# Altium project Blackbox_v3.PrjPcb
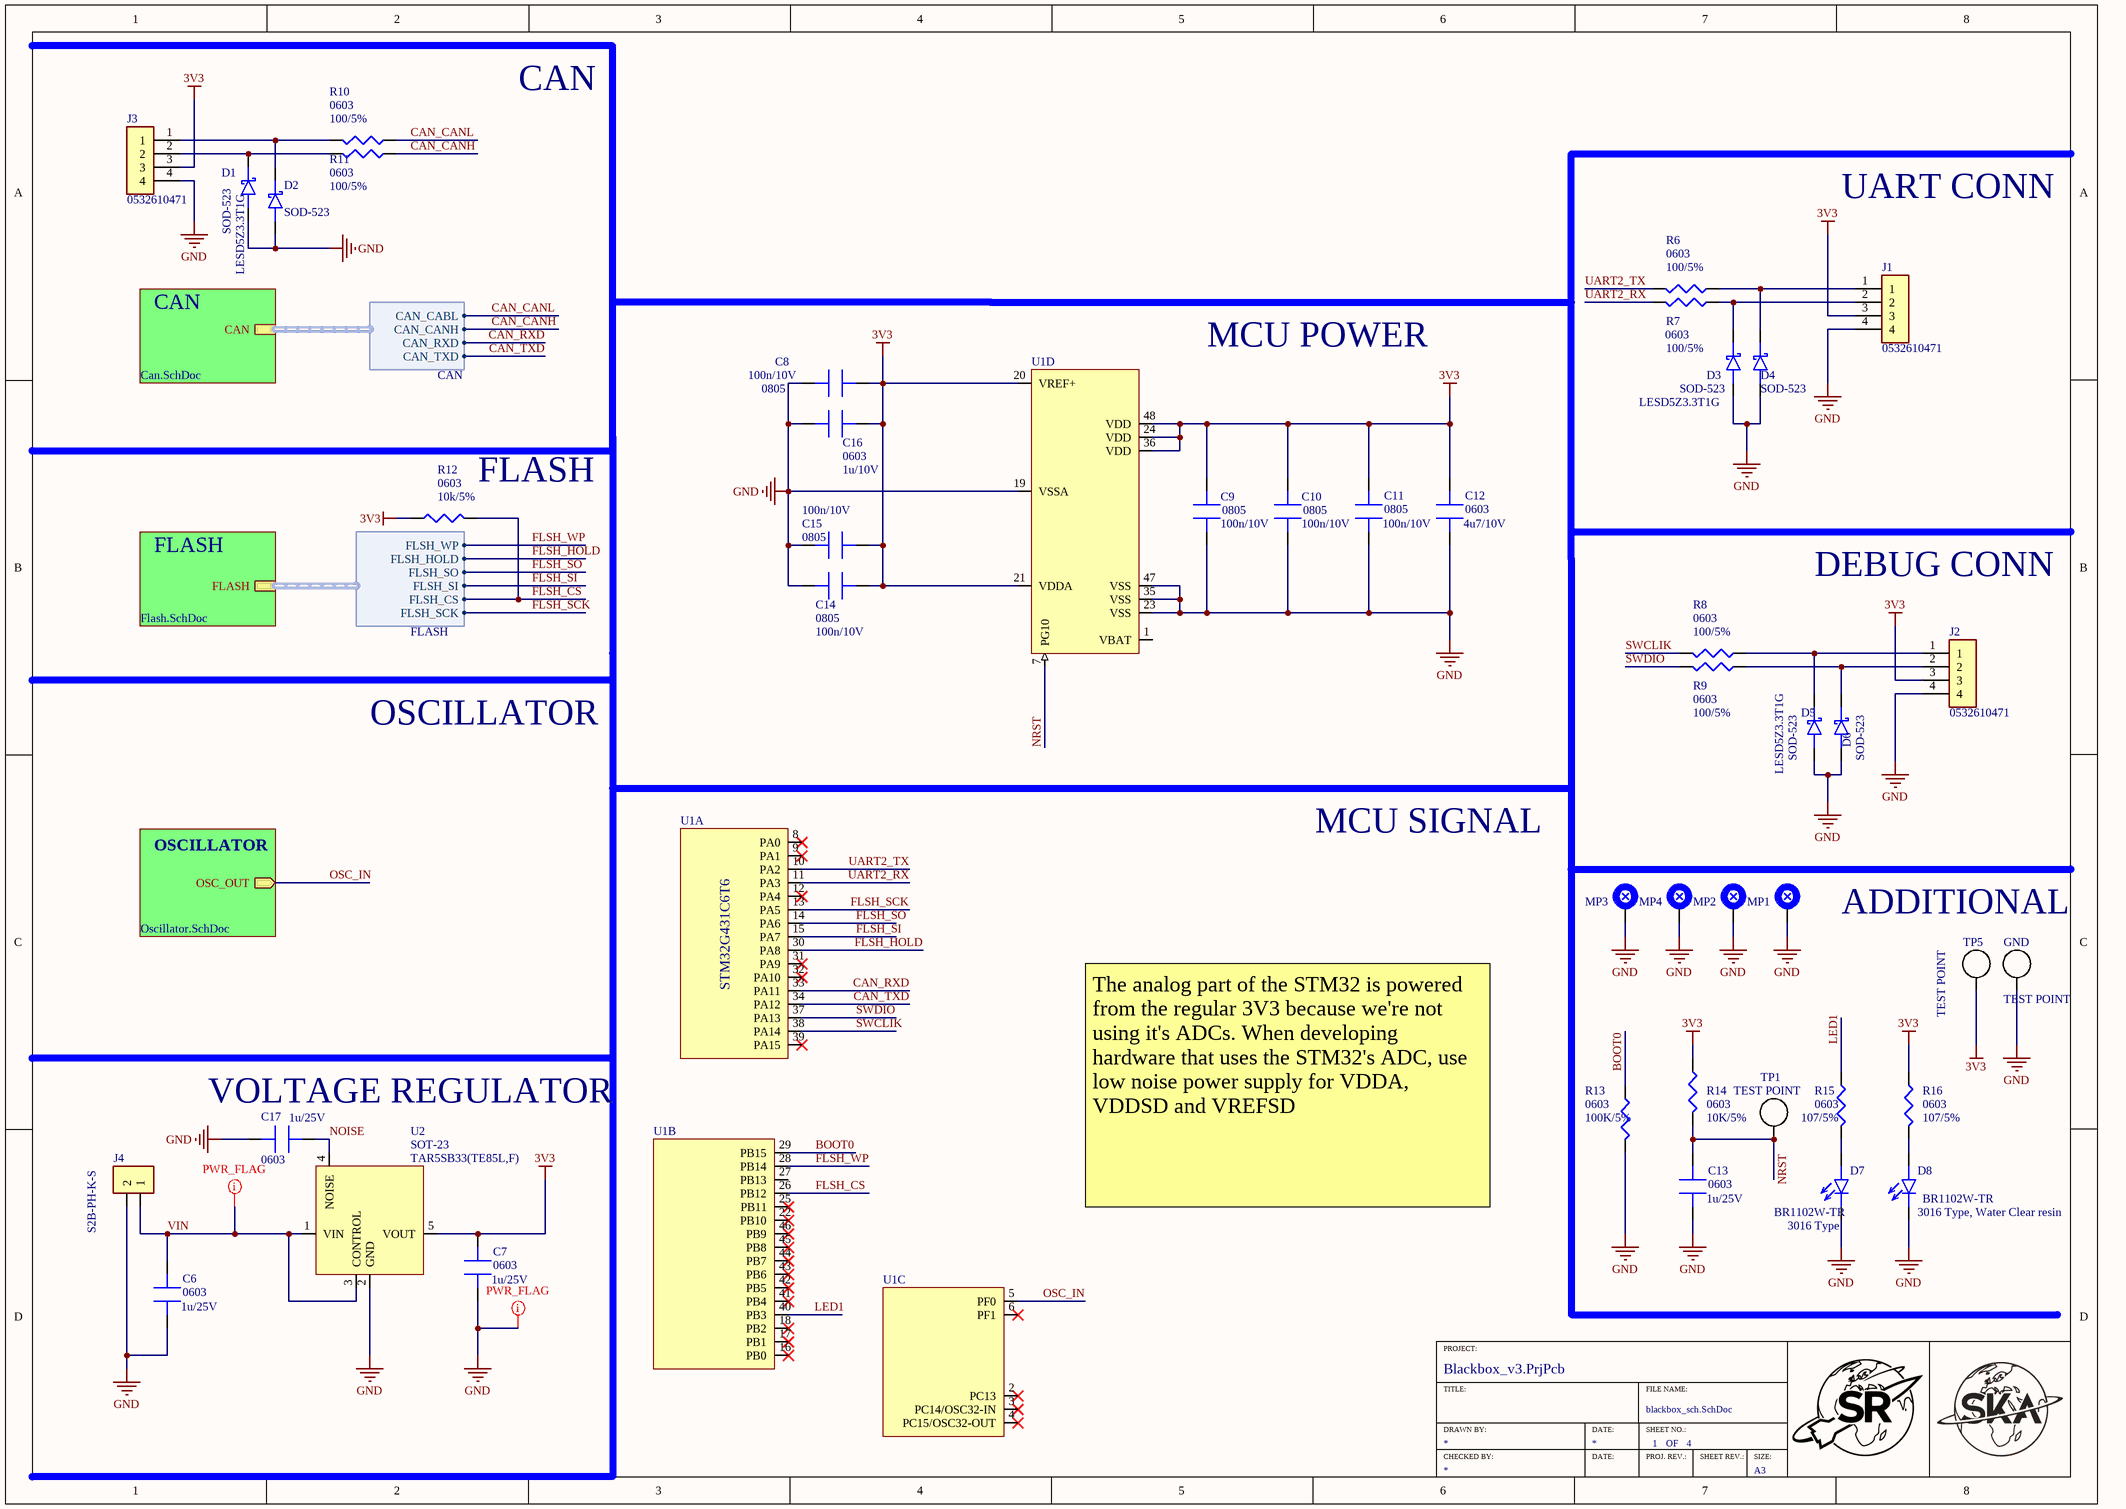
[diagram p0: blackbox_sch.SchDoc]
4 sheets, 58 parts. Net scope: hierarchical (ports join the sheet entries above them; power ports are global).
Board file: BLCK-V3.PcbDoc
Sheets:
  blackbox_sch.SchDoc
    CAN = Can.SchDoc
    FLASH = Flash.SchDoc
    OSCILLATOR = Oscillator.SchDoc

## Sheet blackbox_sch.SchDoc
size A3; Organization: Altium Limited; Address1: L3, 12a Rodborough Rd; Address2: Frenchs Forest; Address3: NSW; Address4: Australia 2086; SheetNumber: 1; SheetTotal: 4

### Parts
C6  value 1u/25V  Package: 0603  [CAPC1608X10L [0603]]  (hidden comment: C)
C7  value 1u/25V  Package: 0603  [CAPC1608X10L [0603]]  (hidden comment: C)
C8  value 100n/10V  Package: 0805  [CAPC2012X09L [0805]]  (hidden comment: C)
C9  value 100n/10V  Package: 0805  [CAPC2012X09L [0805]]  (hidden comment: C)
C10  value 100n/10V  Package: 0805  [CAPC2012X09L [0805]]  (hidden comment: C)
C11  value 100n/10V  Package: 0805  [CAPC2012X09L [0805]]  (hidden comment: C)
C12  value 4u7/10V  Package: 0603  [CAPC1608X10L [0603]]  (hidden comment: C)
C13  value 1u/25V  Package: 0603  [CAPC1608X10L [0603]]  (hidden comment: C)
C14  value 100n/10V  Package: 0805  [CAPC2012X09L [0805]]  (hidden comment: C)
C15  value 100n/10V  Package: 0805  [CAPC2012X09L [0805]]  (hidden comment: C)
C16  value 1u/10V  Package: 0603  [CAPC1608X10L [0603]]  (hidden comment: C)
C17  value 1u/25V  Package: 0603  [CAPC1608X10L [0603]]  (hidden comment: C)
D1  LESD5Z3.3T1G  Package: SOD-523  [sSchottky]
D2  Package: SOD-523  [sSchottky]  (hidden comment: LESD5Z3.3T1G)
D3  LESD5Z3.3T1G  Package: SOD-523  [sSchottky]
D4  Package: SOD-523  [sSchottky]  (hidden comment: LESD5Z3.3T1G)
D5  LESD5Z3.3T1G  Package: SOD-523  [sSchottky]
D6  Package: SOD-523  [sSchottky]  (hidden comment: LESD5Z3.3T1G)
D7  BR1102W-TR  Package: 3016 Type  [SODFL160X130-2N]
D8  Package: 3016 Type, Water Clear resin  [SODFL160X130-2N]  (hidden comment: BR1102W-TR)
GND  TEST POINT  [TEST POINT]
J1  0532610471  [MOLEX_0532610471]
J2  0532610471  [MOLEX_0532610471]
J3  0532610471  [MOLEX_0532610471]
J4  PN: S2B-PH-K-S  [JST_PH_S2B-PH-K-S]  (hidden comment: JST_PH_S2B-PH-K-S)
MP1  Mounting hole  [Mounting_hole_M3]  (value not drawn)
MP2  Mounting hole  [Mounting_hole_M3]  (value not drawn)
MP3  Mounting hole  [Mounting_hole_M3]  (value not drawn)
MP4  Mounting hole  [Mounting_hole_M3]  (value not drawn)
R6  value 100/5%  Package: 0603  [RESC1608X05L [0603]]  (hidden comment: R)
R7  value 100/5%  Package: 0603  [RESC1608X05L [0603]]  (hidden comment: R)
R8  value 100/5%  Package: 0603  [RESC1608X05L [0603]]  (hidden comment: R)
R9  value 100/5%  Package: 0603  [RESC1608X05L [0603]]  (hidden comment: R)
R10  value 100/5%  Package: 0603  [RESC1608X05L [0603]]  (hidden comment: R)
R11  value 100/5%  Package: 0603  [RESC1608X05L [0603]]  (hidden comment: R)
R12  value 10k/5%  Package: 0603  [RESC1608X05L [0603]]  (hidden comment: R)
R13  value 100K/5%  Package: 0603  [RESC1608X05L [0603]]  (hidden comment: R)
R14  value 10K/5%  Package: 0603  [RESC1608X05L [0603]]  (hidden comment: R)
R15  value 107/5%  Package: 0603  [RESC1608X05L [0603]]  (hidden comment: R)
R16  value 107/5%  Package: 0603  [RESC1608X05L [0603]]  (hidden comment: R)
TP1  TEST POINT  [TEST POINT]
TP5  TEST POINT  [TEST POINT]
U1  IC MCU 32BIT 32KB FLASH 48LQFP  [TSQFP50P900X900X160-48N]  (value not drawn)  (parts A,B,C,D of 4)
U2  Paclage: SOT-23  [SOT95P275X140-5N]  (hidden comment: LDO Voltage Regulators)

### Sub-sheets
CAN = Can.SchDoc: CAN (harness CAN)
FLASH = Flash.SchDoc: FLASH (harness FLASH)
OSCILLATOR = Oscillator.SchDoc: OSC_OUT (out)

### Harnesses
FLASH: FLSH_SCK, FLSH_CS, FLSH_SI, FLSH_SO, FLSH_HOLD, FLSH_WP
CAN: CAN_TXD, CAN_RXD, CAN_CANH, CAN_CABL

### Nets
3V3: C7.2 C8.2 C9.2 C10.2 C11.2 C12.2 C14.1 C15.1 C16.2 J1.3 J2.3 J3.3 R12.2 R14.2 R16.2 TP5.1 U1.20(VREF+) U1.21(VDDA) U1.24(VDD) U1.36(VDD) U1.48(VDD) U2.5(VOUT)
GND: C6.1 C7.1 C8.1 C9.1 C10.1 C11.1 C12.1 C13.1 C14.2 C15.2 C16.1 C17.1 D1.2 D2.2 D3.2 D4.2 D5.2 D6.2 D7.1 D8.1 GND.1 J1.4 J2.4 J3.4 J4.2 MP1.1 MP2.1 MP3.1 MP4.1 R13.1 U1.19(VSSA) U1.23(VSS) U1.35(VSS) U1.47(VSS) U2.2(GND)
BOOT0: R13.2 U1.29(PB15)
CAN_CANH: R11.2 ; sheet CAN/CAN.CAN_CANH
CAN_CANL: R10.2 ; sheet CAN/CAN.CAN_CABL
CAN_RXD: U1.33(PA11) ; sheet CAN/CAN.CAN_RXD
CAN_TXD: U1.34(PA12) ; sheet CAN/CAN.CAN_TXD
FLSH_CS: R12.1 U1.26(PB12) ; sheet FLASH/FLASH.FLSH_CS
FLSH_HOLD: U1.30(PA8) ; sheet FLASH/FLASH.FLSH_HOLD
FLSH_SCK: U1.13(PA5) ; sheet FLASH/FLASH.FLSH_SCK
FLSH_SI: U1.15(PA7) ; sheet FLASH/FLASH.FLSH_SI
FLSH_SO: U1.14(PA6) ; sheet FLASH/FLASH.FLSH_SO
FLSH_WP: U1.28(PB14) ; sheet FLASH/FLASH.FLSH_WP
LED1: R15.2 U1.40(PB3)
NOISE: C17.2 U2.4(NOISE)
NRST: C13.2 R14.1 TP1.1 U1.7(PG10)
OSC_IN: U1.5(PF0) ; sheet OSCILLATOR/OSC_OUT
SWCLIK: R8.1 U1.38(PA14)
SWDIO: R9.1 U1.37(PA13)
UART2_RX: R7.1 U1.11(PA3)
UART2_TX: R6.1 U1.10(PA2)
VIN: C6.2 J4.1 U2.1(VIN) U2.3(CONTROL)
NetD1_1: D1.1 J3.2 R11.1
NetD2_1: D2.1 J3.1 R10.1
NetD3_1: D3.1 J1.2 R7.2
NetD4_1: D4.1 J1.1 R6.2
NetD5_1: D5.1 J2.1 R8.2
NetD6_1: D6.1 J2.2 R9.2
NetD7_2: D7.2 R15.1
NetD8_2: D8.2 R16.1

Not connected (* = marked no-connect by the designer): U1 1(VBAT) 2(PC13)* 3(PC14/OSC32-IN)* 4(PC15/OSC32-OUT)* 6(PF1)* 8(PA0)* 9(PA1)* 12(PA4)* 16(PB0)* 17(PB1)* 18(PB2)* 22(PB10)* 25(PB11)* 27(PB13) 31(PA9)* 32(PA10)* 39(PA15)* 41(PB4)* 42(PB5)* 43(PB6)* 44(PB7)* 45(PB8)* 46(PB9)*

### Layout directives
Electrical type: Power output; net class PWR_FLAG: GND, VIN

### Notes on the sheet
- CAN
- UART CONN
- MCU POWER
- (near R12) FLASH
- DEBUG CONN
- OSCILLATOR
- MCU SIGNAL
- ADDITIONAL
- (near C17) VOLTAGE REGULATOR
- The analog part of the STM32 is powered from the regular 3V3 because we're not using it's ADCs. When developing hardware that uses the STM32's ADC, use low noise power supply for VDDA, VDDSD and VREFSD
- TITLE:
- PROJECT:
- FILE NAME:
- DRAWN BY:
- CHECKED BY:
- DATE:
- SHEET NO.:
- PROJ. REV.:
- OF
- SHEET REV.:
- SIZE:
- A3

### Library data of the parts
C6-C17 = C: Standard capacitor
D1-D6 = sSchottky: Stand−off Voltage:  2.5 V −12 V / Peak Power up to 200
D7 D8 = sLED: Standard LEDs - SMD Surface Mount LED; Supplier 1: Arrow Electronics; Supplier Part Number 1: BR1102W-TR
J1-J3 = MOLEX_PicoBlade: Connector Header Surface Mount, Right Angle 4 position 0.049" (1.25mm); Package: Tape & Reel (TR); HelpUrl: https://www.digikey.com/en/products/detail/molex/0532610471/699096
J4 = JST_PH_S2B-PH-K-S: JST 2-pin connector, male, horizontal, pitch 2.00mm; HelpURL: https://www.tme.eu/Document/bde47a97a79ef7b2143e7f603cd40725/PH.pdf
R6-R16 = R: Standard resistor
U1 = STM32G431C6T6: ARM® Cortex®-M4F series Microcontroller IC 32-Bit Single-Core 170MHz 32KB (32K x 8) FLASH 48-LQFP (7x7)
U2 = TAR5SB33(TE85L,F): LDO Voltage Regulators Point Reg SGL output 200mA 15V 3.3Vout; HelpURL: https://eu.mouser.com/datasheet/2/408/TAR5SB18_datasheet_en_20140301-1627700.pdf; Supplier part number: TAR5SB33(TE85L,F)

## Sheet Can.SchDoc
size A3; Organization: Altium Limited; Address1: L3, 12a Rodborough Rd; Address2: Frenchs Forest; Address3: NSW; Address4: Australia 2086; SheetNumber: 2; SheetTotal: 4
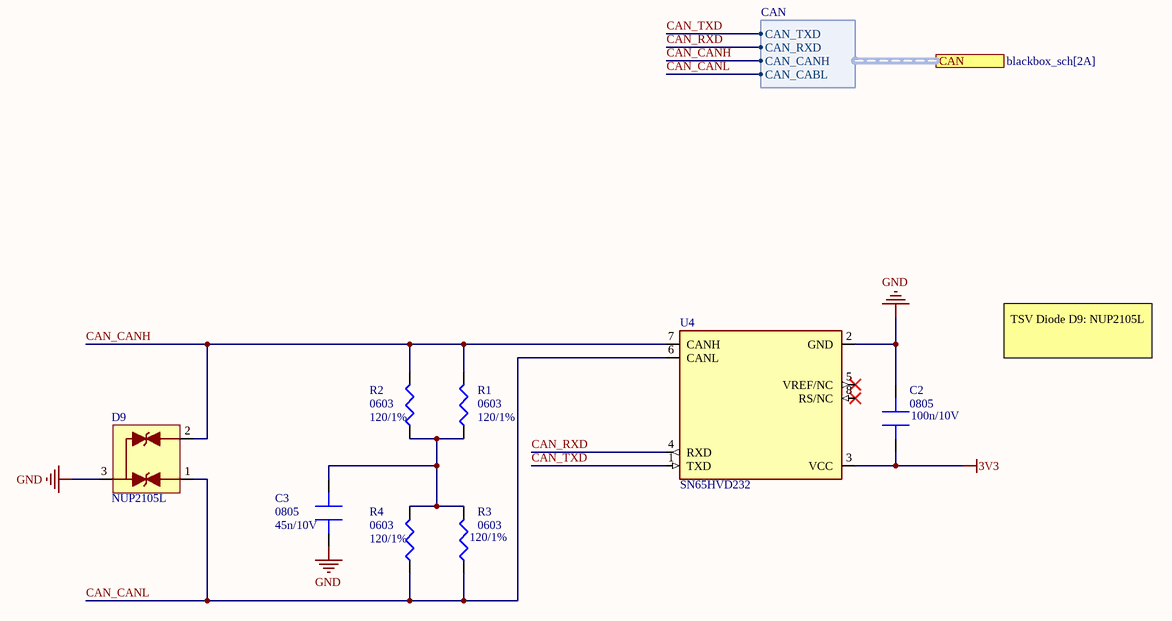
[diagram p1: Can.SchDoc]

### Parts
C2  value 100n/10V  Package: 0805  [CAPC2012X09L [0805]]  (hidden comment: C)
C3  value 45n/10V  Package: 0805  [CAPC2012X09L [0805]]  (hidden comment: C)
D9  NUP2105L  [SOT95P237X111-3N [SOT23]]
R1  value 120/1%  Package: 0603  [RESC1608X05L [0603]]  (hidden comment: R)
R2  value 120/1%  Package: 0603  [RESC1608X05L [0603]]  (hidden comment: R)
R3  value 120/1%  Package: 0603  [RESC1608X05L [0603]]  (hidden comment: R)
R4  value 120/1%  Package: 0603  [RESC1608X05L [0603]]  (hidden comment: R)
U4  PN: SN65HVD232  [SOIC127P600X175-8N]  (hidden comment: SN65HVD23x)

### Ports
CAN (harness CAN, see blackbox_sch[2A])

### Harnesses
CAN: CAN_TXD, CAN_RXD, CAN_CANH, CAN_CABL

### Nets
3V3: C2.1 U4.3(VCC)
GND: C2.2 C3.1 D9.3 U4.2(GND)
CAN_CANH: D9.2 R1.2 R2.1 U4.7(CANH) ; port CAN.CAN_CANH
CAN_CANL: D9.1 R3.1 R4.1 U4.6(CANL) ; port CAN.CAN_CABL
CAN_RXD: U4.4(RXD) ; port CAN.CAN_RXD
CAN_TXD: U4.1(TXD) ; port CAN.CAN_TXD
NetC3_2: C3.2 R1.1 R2.2 R3.2 R4.2

Not connected (* = marked no-connect by the designer): U4 5(VREF/NC)* 8(RS/NC)*

### Notes on the sheet
- TSV Diode D9: NUP2105L
- TITLE:
- PROJECT:
- FILE NAME:
- DRAWN BY:
- CHECKED BY:
- DATE:
- SHEET NO.:
- PROJ. REV.:
- OF
- SHEET REV.:
- SIZE:
- A3

### Library data of the parts
C2 C3 = C: Standard capacitor
D9 = NUP2105L: ESD protection diode - dual line CAN bus protector; HelpURL: https://www.onsemi.com/pub/Collateral/NUP2105L-D.PDF; PN: NUP2105L
R1-R4 = R: Standard resistor
U4 = SN65HVD23x: CAN bus transceiver, 3V3; HelpURL: https://www.ti.com/lit/ds/symlink/sn65hvd230.pdf

## Sheet Flash.SchDoc
size A3; Organization: Altium Limited; Address1: L3, 12a Rodborough Rd; Address2: Frenchs Forest; Address3: NSW; Address4: Australia 2086; SheetNumber: 3; SheetTotal: 4
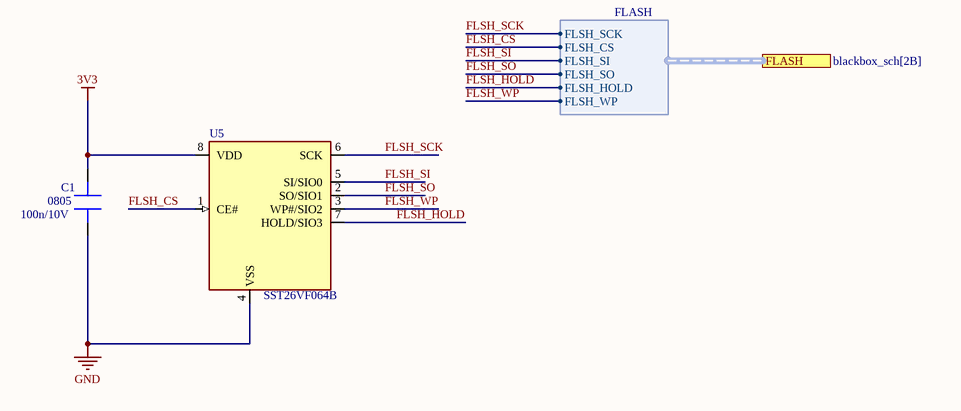
[diagram p2: Flash.SchDoc]

### Parts
C1  value 100n/10V  Package: 0805  [CAPC2012X09L [0805]]  (hidden comment: C)
U5  PN: SST26VF064B  [SON127P500X80-8N_T]  (hidden comment: SST26VF064B/BA)

### Ports
FLASH (harness FLASH, see blackbox_sch[2B])

### Harnesses
FLASH: FLSH_SCK, FLSH_CS, FLSH_SI, FLSH_SO, FLSH_HOLD, FLSH_WP

### Nets
3V3: C1.2 U5.8(VDD)
GND: C1.1 U5.4(VSS)
FLSH_CS: U5.1(CE#) ; port FLASH.FLSH_CS
FLSH_HOLD: U5.7(HOLD/SIO3) ; port FLASH.FLSH_HOLD
FLSH_SCK: U5.6(SCK) ; port FLASH.FLSH_SCK
FLSH_SI: U5.5(SI/SIO0) ; port FLASH.FLSH_SI
FLSH_SO: U5.2(SO/SIO1) ; port FLASH.FLSH_SO
FLSH_WP: U5.3(WP#/SIO2) ; port FLASH.FLSH_WP

### Notes on the sheet
- TITLE:
- PROJECT:
- FILE NAME:
- DRAWN BY:
- CHECKED BY:
- DATE:
- SHEET NO.:
- PROJ. REV.:
- OF
- SHEET REV.:
- SIZE:
- A3

### Library data of the parts
C1 = C: Standard capacitor
U5 = SST26VF064B/BA: 64 Mbit Serial Quad I/O (SQI) Flash Memory, 2V5/3V; HelpURL: http://ww1.microchip.com/downloads/en/DeviceDoc/SST26VF064B-SST26VF064BA-2.5V-3.0V-64-Mbit-Serial-Quad-IO-Flash-Memory-Data-Sheet-DS20005119J.pdf

## Sheet Oscillator.SchDoc
size A3; Organization: Altium Limited; Address1: L3, 12a Rodborough Rd; Address2: Frenchs Forest; Address3: NSW; Address4: Australia 2086; SheetNumber: 4; SheetTotal: 4
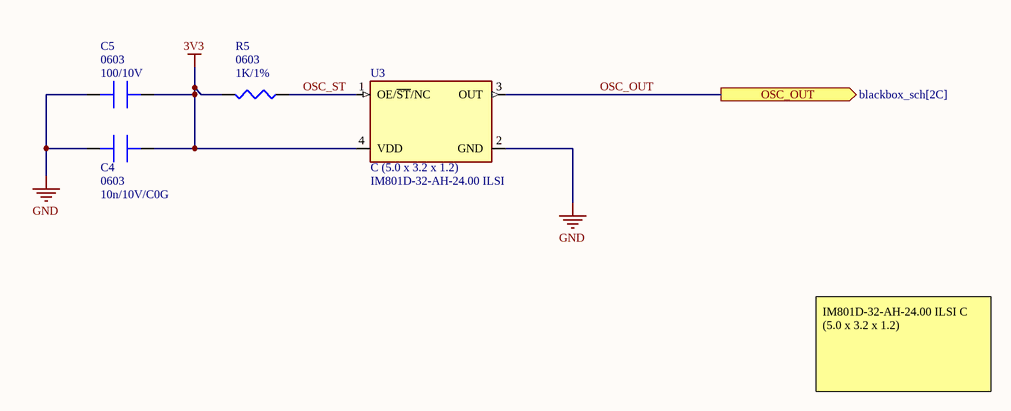
[diagram p3: Oscillator.SchDoc]

### Parts
C4  value 10n/10V/C0G  Package: 0603  [CAPC1608X10L [0603]]  (hidden comment: C)
C5  value 100/10V  Package: 0603  [CAPC1608X10L [0603]]  (hidden comment: C)
R5  value 1K/1%  Package: 0603  [RESC1608X05L [0603]]  (hidden comment: R)
U3  Package: C (5.0 x 3.2 x 1.2)  PN: IM801D-32-AH-24.00 ILSI  [IM801C]  (hidden comment: IM801x-xx-xx-xx.xxx)

### Ports
OSC_OUT (out, see blackbox_sch[2C])

### Nets
3V3: C4.2 C5.2 R5.1 U3.4(VDD)
GND: C4.1 C5.1 U3.2(GND)
OSC_OUT: U3.3(OUT) ; port OSC_OUT  [project net OSC_IN]
OSC_ST: R5.2 U3.1(OE/~{ST}/NC)

### Notes on the sheet
- IM801D-32-AH-24.00 ILSI C (5.0 x 3.2 x 1.2)
- TITLE:
- PROJECT:
- FILE NAME:
- DRAWN BY:
- CHECKED BY:
- DATE:
- SHEET NO.:
- PROJ. REV.:
- OF
- SHEET REV.:
- SIZE:
- A3

### Library data of the parts
C4 C5 = C: Standard capacitor
R5 = R: Standard resistor
U3 = IM801x-xx-xx-xx.xxx: MEMS oscillator, low power, LVCMOS; HelpURL: https://www.tme.eu/Document/af49f0dca67518895ecb09acc4553fdf/IM801_Series_16_A.pdf

## Nets that join several sheets
3V3: blackbox_sch (22 pins), Can (C2.1 U4.3), Flash (C1.2 U5.8), Oscillator (C4.2 C5.2 R5.1 U3.4)
GND: blackbox_sch (35 pins), Can (C2.2 C3.1 D9.3 U4.2), Flash (C1.1 U5.4), Oscillator (C4.1 C5.1 U3.2)
CAN_CANH: blackbox_sch (R11.2), Can (D9.2 R1.2 R2.1 U4.7)
CAN_CANL: blackbox_sch (R10.2), Can (D9.1 R3.1 R4.1 U4.6)
CAN_RXD: blackbox_sch (U1.33), Can (U4.4)
CAN_TXD: blackbox_sch (U1.34), Can (U4.1)
FLSH_CS: blackbox_sch (R12.1 U1.26), Flash (U5.1)
FLSH_HOLD: blackbox_sch (U1.30), Flash (U5.7)
FLSH_SCK: blackbox_sch (U1.13), Flash (U5.6)
FLSH_SI: blackbox_sch (U1.15), Flash (U5.5)
FLSH_SO: blackbox_sch (U1.14), Flash (U5.2)
FLSH_WP: blackbox_sch (U1.28), Flash (U5.3)
OSC_IN: blackbox_sch (U1.5), Oscillator (U3.3)